# EAGLE design OpenEVSE_PLUS_v2_30a (EAGLE 6.5.0)
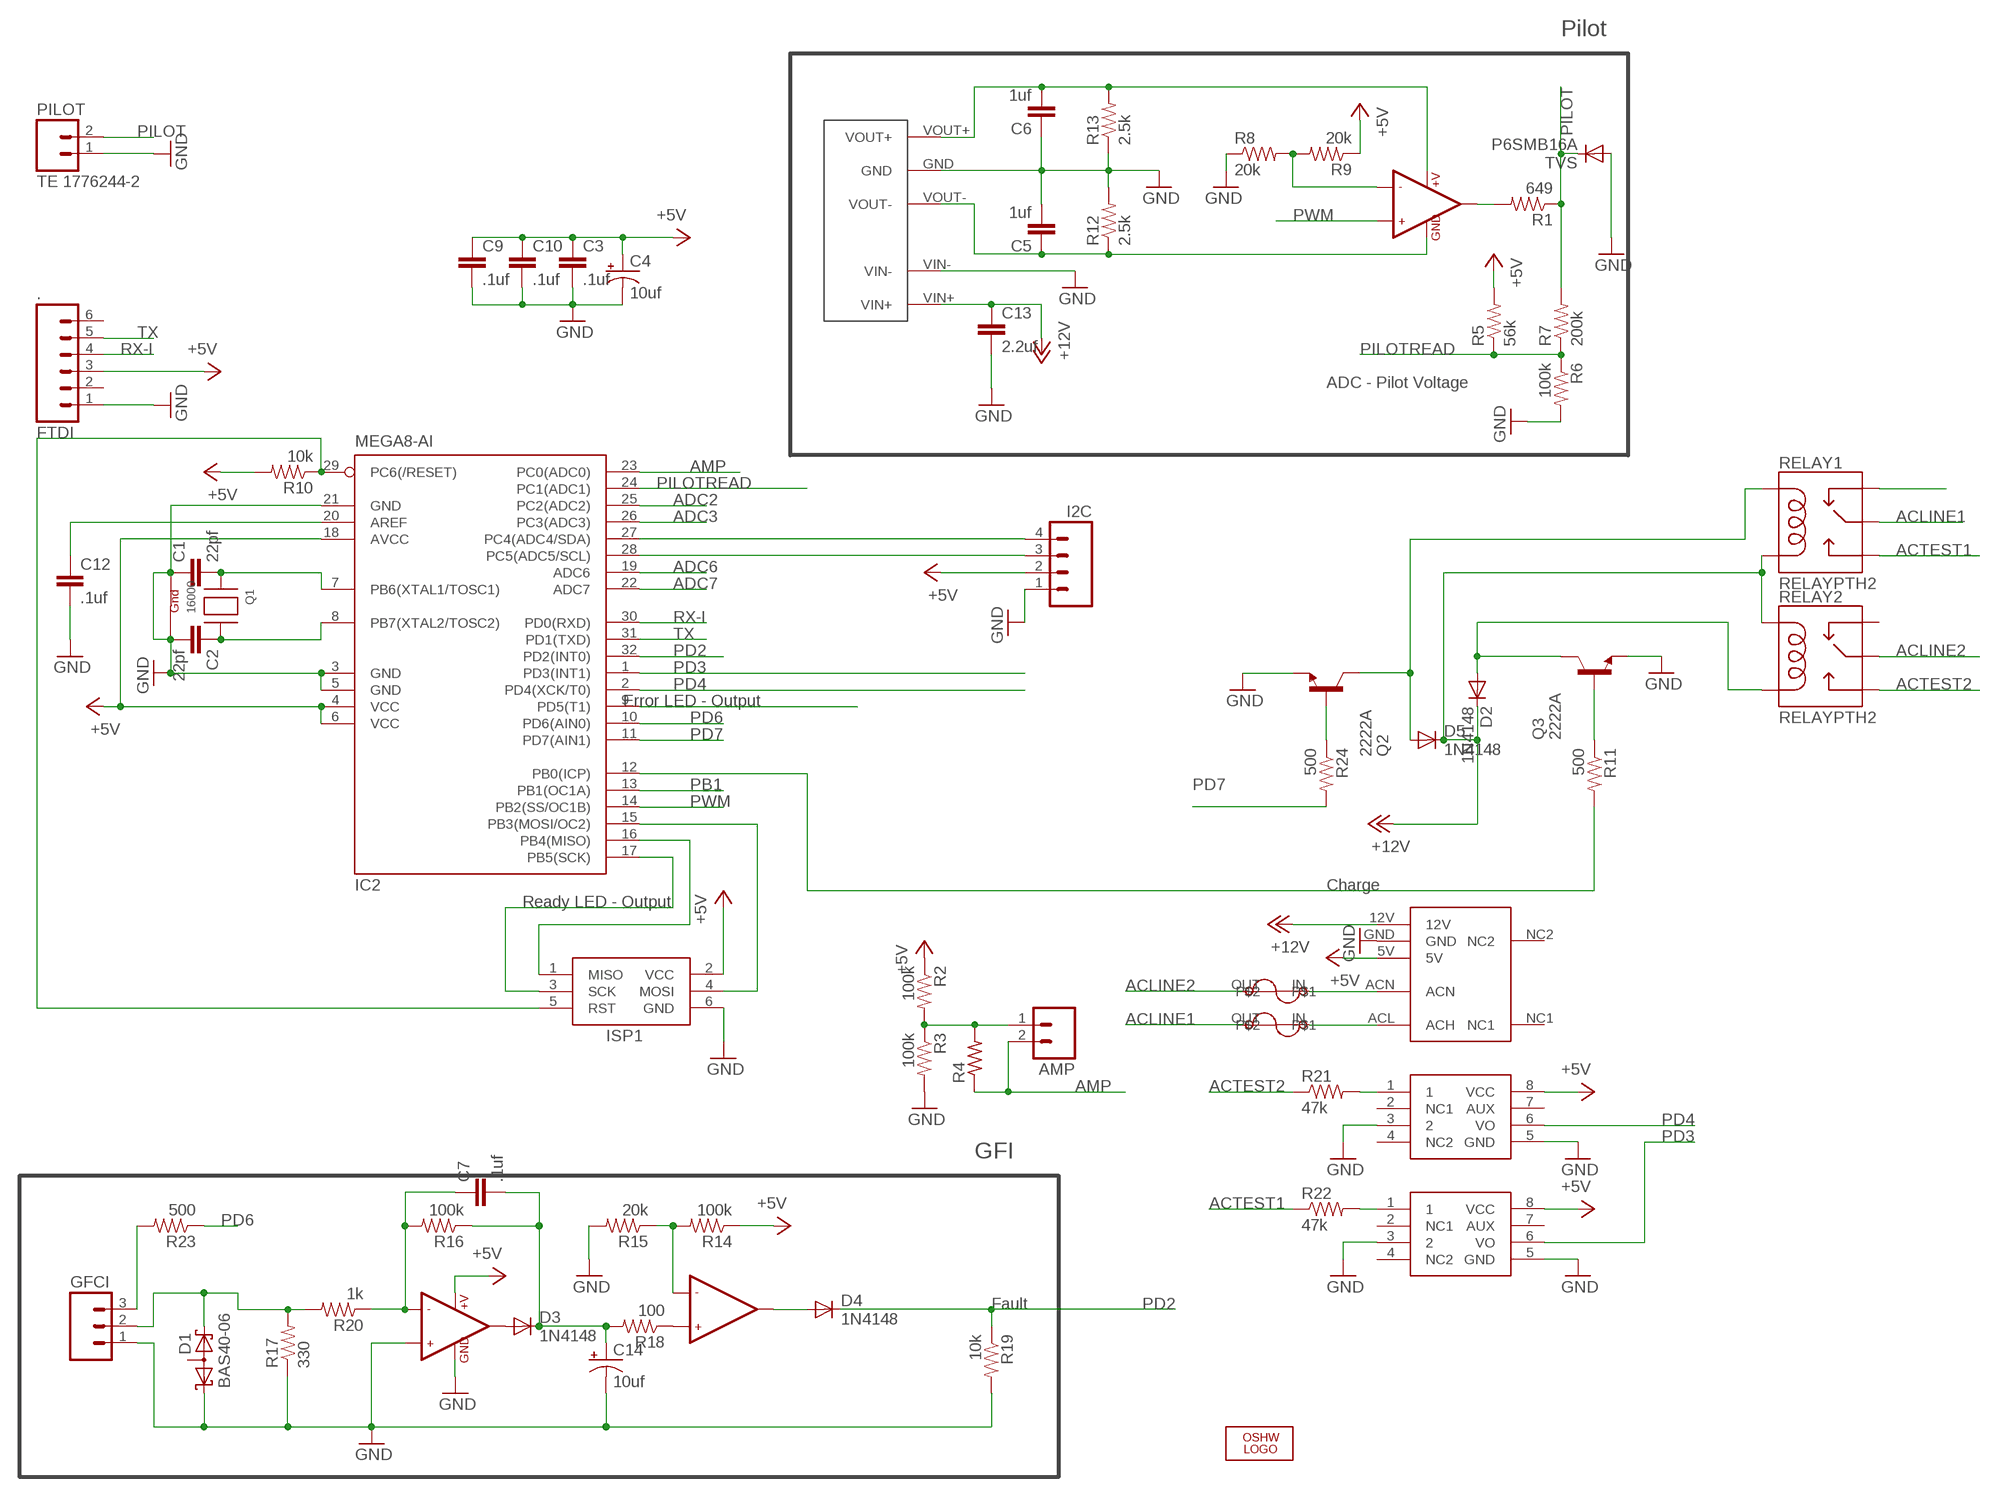
[diagram p0: schematic, sheet 1]

## Parts
.  FTDI  M06LOCK  [1X06_LOCK]
AMP  M02LOCK  [1X02_LOCK]
C1  22pf  CAP0805  [0805]
C2  22pf  CAP0805  [0805]
C3  .1uf  CAP0805  [0805]
C4  10uf  CAP_POL1206  [EIA3216]
C5  1uf  CAP0805  [0805]
C6  1uf  CAP0805  [0805]
C7  .1uf  CAP0805  [0805]
C9  .1uf  CAP0805  [0805]
C10  .1uf  CAP0805  [0805]
C12  .1uf  CAP0805  [0805]
C13  2.2uf  CAP0805  [0805]
C14  10uf  CAP_POL1206  [EIA3216]
D1  BAS40-06  [SOT23]
D2  1N4148  DIODE-SOD123  [SOD123]
D3  1N4148  DIODE-SOD123  [SOD123]
D4  1N4148  DIODE-SOD123  [SOD123]
D5  1N4148  DIODE-SOD123  [SOD123]
DCDC  D107E  DCDC_SIP  [DCDC_SIP]
GFCI  M03LOCK  [1X03_LOCK]
I2C  M04LOCK  [1X04_LOCK]
IC1  MID400  [DIP08]
IC2  MEGA8-AI  [TQFP32-08]
IC3  LMV358  [SO08]
IC4  LMV358  [SO08]
IC5  MID400  [DIP08]
ISP1  AVRISP-6  [AVRISP]
LOGO1  OSHW_LOGO_8MILX0150-NT  [OSHW_8X150_NOTEXT]
PILOT  TE 1776244-2  M025MM  [SCREWTERMINAL-5MM-2]
Q1  16000  XTAL-4-3225  [NX3225]
Q2  2222A  BCX70SMD  [SOT23]
Q3  2222A  BCX70SMD  [SOT23]
R1  649  RESISTOR0805-RES  [0805]
R2  100k  RESISTOR0805-RES  [0805]
R3  100k  RESISTOR0805-RES  [0805]
R4  R-US_0207/2V  [0207/2V]
R5  56k  RESISTOR0805-RES  [0805]
R6  100k  RESISTOR0805-RES  [0805]
R7  200k  RESISTOR0805-RES  [0805]
R8  20k  RESISTOR0805-RES  [0805]
R9  20k  RESISTOR0805-RES  [0805]
R10  10k  RESISTOR0805-RES  [0805]
R11  500  RESISTOR0805-RES  [0805]
R12  2.5k  RESISTOR0805-RES  [0805]
R13  2.5k  RESISTOR0805-RES  [0805]
R14  100k  RESISTOR0805-RES  [0805]
R15  20k  RESISTOR0805-RES  [0805]
R16  100k  RESISTOR0805-RES  [0805]
R17  330  RESISTOR0805-RES  [0805]
R18  100  RESISTOR0805-RES  [0805]
R19  10k  RESISTOR0805-RES  [0805]
R20  1k  RESISTOR0805-RES  [0805]
R21  47k  RESISTORPTH-1/4W  [AXIAL-0.4]
R22  47k  RESISTORPTH-1/4W  [AXIAL-0.4]
R23  500  RESISTOR0805-RES  [0805]
R24  500  RESISTOR0805-RES  [0805]
RELAY1  RELAYPTH2  [RELAY-T9A]
RELAY2  RELAYPTH2  [RELAY-T9A]
TVS  P6SMB16A  DIODE-SMB  [SMB]
U$1  MPM-04E-1205  [MPM-04E-1205]
U$2  BEL1AFUSE  [BELFUSE1A]
U$5  BEL1AFUSE  [BELFUSE1A]

## Nets
12V: C6.2 DCDC.VOUT+ IC4.8(+V) R13.2
+5V: ..3 C3.1 C4.A(+) C9.1 C10.1 I2C.2 IC1.8(VCC) IC2.4(VCC) IC2.6(VCC) IC2.18(AVCC) IC3.8(+V) IC5.8(VCC) ISP1.2(VCC) R2.1 R5.2 R9.1 R10.2 R14.1 U$1.5V
+12V: C13.1 D2.C D5.C DCDC.VIN+ RELAY1.COIL2 RELAY2.COIL1 U$1.12V
-12V: C5.1 DCDC.VOUT- IC4.4(GND) R12.1
ACLINE1: RELAY1.MAIN U$2.OUT
ACLINE2: RELAY2.MAIN U$5.OUT
ACTEST1: R22.P$1 RELAY1.NO
ACTEST2: R21.P$1 RELAY2.NO
ADC2: IC2.25(PC2(ADC2))
ADC3: IC2.26(PC3(ADC3))
ADC6: IC2.19(ADC6)
ADC7: IC2.22(ADC7)
AMP: AMP.2 IC2.23(PC0(ADC0)) R4.1
CTA1: AMP.1 R2.2 R3.1 R4.2
GND: ..1 C1.1 C2.2 C3.2 C4.C(-) C5.2 C6.1 C9.2 C10.2 C12.2 C13.2 C14.C(-) D1.1(K1) DCDC.GND DCDC.VIN- GFCI.1 I2C.1 IC1.3 IC1.5(GND) IC2.3(GND) IC2.5(GND) IC2.21(GND) IC3.3(+IN1) IC3.4(GND) IC5.3 IC5.5(GND) ISP1.6(GND) PILOT.1 Q1.1(G1) Q1.3(G2) Q2.2(E) Q3.2(E) R3.2 R6.2 R8.1 R12.2 R13.1 R15.2 R17.1 R19.2 TVS.A U$1.GND
N$1: RELAY1.NC
N$2: Q3.1(B) R11.1
N$4: C1.2 IC2.7(PB6(XTAL1/TOSC1)) Q1.2(X1)
N$5: C2.1 IC2.8(PB7(XTAL2/TOSC2)) Q1.4(X2)
N$7: U$1.ACL(ACH) U$2.IN
N$8: C7.1 IC3.2(-IN1) R16.2 R20.1
N$9: U$1.ACN U$5.IN
N$10: IC4.2(-IN1) R8.2 R9.2
N$11: IC4.1(OUT1) R1.2
N$14: IC2.15(PB3(MOSI/OC2)) ISP1.4(MOSI)
N$15: IC2.17(PB5(SCK)) ISP1.3(SCK)
N$16: IC2.16(PB4(MISO)) ISP1.1(MISO)
N$18: IC1.1 R21.P$2
N$19: IC5.1 R22.P$2
N$20: D1.2(K2) GFCI.2 R17.2 R20.2
N$21: D3.A IC3.1(OUT1)
N$22: GFCI.3 R23.2
N$23: C7.2 C14.A(+) D3.C R16.1 R18.2
N$24: IC3.6(-IN2) R14.2 R15.1
N$25: D4.A IC3.7(OUT2)
N$26: IC3.5(+IN2) R18.1
N$27: D5.A Q2.3(C) RELAY1.COIL1
N$30: Q2.1(B) R24.1
N$34: IC2.12(PB0(ICP)) R11.2
N$36: IC2.9(PD5(T1))
N$39: I2C.4 IC2.27(PC4(ADC4/SDA))
N$40: I2C.3 IC2.28(PC5(ADC5/SCL))
N$44: C12.1 IC2.20(AREF)
PB1: IC2.13(PB1(OC1A))
PD2: D4.C IC2.32(PD2(INT0)) R19.1
PD3: IC2.1(PD3(INT1)) IC5.6(VO)
PD4: IC1.6(VO) IC2.2(PD4(XCK/T0))
PD6: IC2.10(PD6(AIN0)) R23.1
PD7: IC2.11(PD7(AIN1)) R24.2
PILOT: PILOT.2 R1.1 R7.2 TVS.C
PILOTREAD: IC2.24(PC1(ADC1)) R5.1 R6.1 R7.1
PWM: IC2.14(PB2(SS/OC1B)) IC4.3(+IN1)
RELAY: D2.A Q3.3(C) RELAY2.COIL2
RST: IC2.29(PC6(/RESET)) ISP1.5(RST) R10.1
RX-I: ..4 IC2.30(PD0(RXD))
TX: ..5 IC2.31(PD1(TXD))
Unconnected: ..2 ..6 D1.3(AA) IC1.2(NC1) IC1.4(NC2) IC1.7(AUX) IC4.5(+IN2) IC4.6(-IN2) IC4.7(OUT2) IC5.2(NC1) IC5.4(NC2) IC5.7(AUX) RELAY2.NC U$1.NC1 U$1.NC2

## Notes on the sheet
- Pilot
- ADC - Pilot Voltage
- Error LED - Output
- Charge
- Ready LED - Output
- GFI
- Fault

## Library data of the parts
. = SparkFun:M06: Header 6 Standard 6-pin 0.1" header. Use with straight break away headers (SKU : PRT-00116), right angle break away headers (PRT-00553), swiss pins (PRT-00743), machine pins (PRT-00117), and female headers (PRT-00115). Molex polarized connector foot print use with SKU : PRT-08094 with associated crimp pins and housings. NOTES ON THE VARIANTS LOCK and LOCK_LONGPADS... This footprint was designed to help hold the alignment of a through-hole component (i.e. 6-pin header) while soldering it into place. You may notice that each hole has been shifted either up or down by 0.005 of an inch from it's more standard position (which is a perfectly straight line). This slight alteration caused the pins (the squares in the middle) to touch the edges of the holes. Because they are alternating, it causes a "brace" to hold the component in place. 0.005 has proven to be the perfect amount of "off-center" position when using our standard breakaway headers. Although looks a little odd when you look at the bare footprint, once you have a header in there, the alteration is very hard to notice. Also, if you push a header all the way into place, it is covered up entirely on the bottom side. This idea of altering the position of holes to aid alignment will be further integrated into the Sparkfun Library for other footprints. It can help hold any component with 3 or more connection pins.
AMP PILOT = SparkFun:M02: Header 2 Standard 2-pin 0.1" header. Use with straight break away headers (SKU : PRT-00116), right angle break away headers (PRT-00553), swiss pins (PRT-00743), machine pins (PRT-00117), and female headers (PRT-00115). Molex polarized connector foot print use with SKU : PRT-08233 with associated crimp pins and housings.
C1-C3 C5-C7 C9 C10 C12 C13 = SparkFun:CAP: Capacitor Standard 0603 ceramic capacitor, and 0.1" leaded capacitor.
C4 C14 = SparkFun:CAP_POL: Capacitor Polarized These are standard SMD and PTH capacitors. Normally 10uF, 47uF, and 100uF in electrolytic and tantalum varieties. Always verify the external diameter of the through hole cap, it varies with capacity, voltage, and manufacturer. The EIA devices should be standard.
D1 = diode:BAS40-06: Silicon Schottky Diodes General-purpose diode for high-speed switching
D2-D5 TVS = diode:DIODE-: DIODE
DCDC = Qxd:DCDC_SIP
GFCI = SparkFun:M03: Header 3 Standard 3-pin 0.1" header. Use with straight break away headers (SKU : PRT-00116), right angle break away headers (PRT-00553), swiss pins (PRT-00743), machine pins (PRT-00117), and female headers (PRT-00115). Molex polarized connector foot print use with SKU : PRT-08232 with associated crimp pins and housings.
I2C = SparkFun:M04: Header 4 Standard 4-pin 0.1" header. Use with straight break away headers (SKU : PRT-00116), right angle break away headers (PRT-00553), swiss pins (PRT-00743), machine pins (PRT-00117), and female headers (PRT-00115). Molex polarized connector foot print use with SKU : PRT-08231 with associated crimp pins and housings.
IC1 IC5 = SparkFun:MID400
IC2 = atmel:MEGA8: MICROCONTROLLER 8 Kbytes FLASH, 1 kbytes SRAM, 512 bytes EEPROM, USART, 6-channel 10 bit ADC, 2-channel 8 bit ADC Pin compatible with Atmega48, ATMega88, ATMega168 Source: avr.lbr; MPN: ATMEGA8-16AU; OC_FARNELL: 9171371; OC_NEWARK: 73M8863
IC3 IC4 = SparkFun:LMV358
ISP1 = adafruit:AVRISP: AVR ISP HEADER Standard 6 pin header for AVR programming
LOGO1 = ohw-logo:OSHW_LOGO_8MIL
Q1 = adafruit:XTAL-4: Classic 4-pin 3.2 x 2.5mm crystal
Q2 Q3 = transistor-npn:BCX70*: NPN Transistor
R1-R3 R5-R24 = SparkFun:RESISTOR: Resistor Basic schematic elements and footprints for 0603, 1206, and PTH resistors.
R4 = adafruit:R-US_: RESISTOR, American symbol
RELAY1 RELAY2 = SparkFun:RELAY
U$1 = Qxd:MPM-04E-1205
U$2 U$5 = Qxd:BEL1AFUSE

## Board
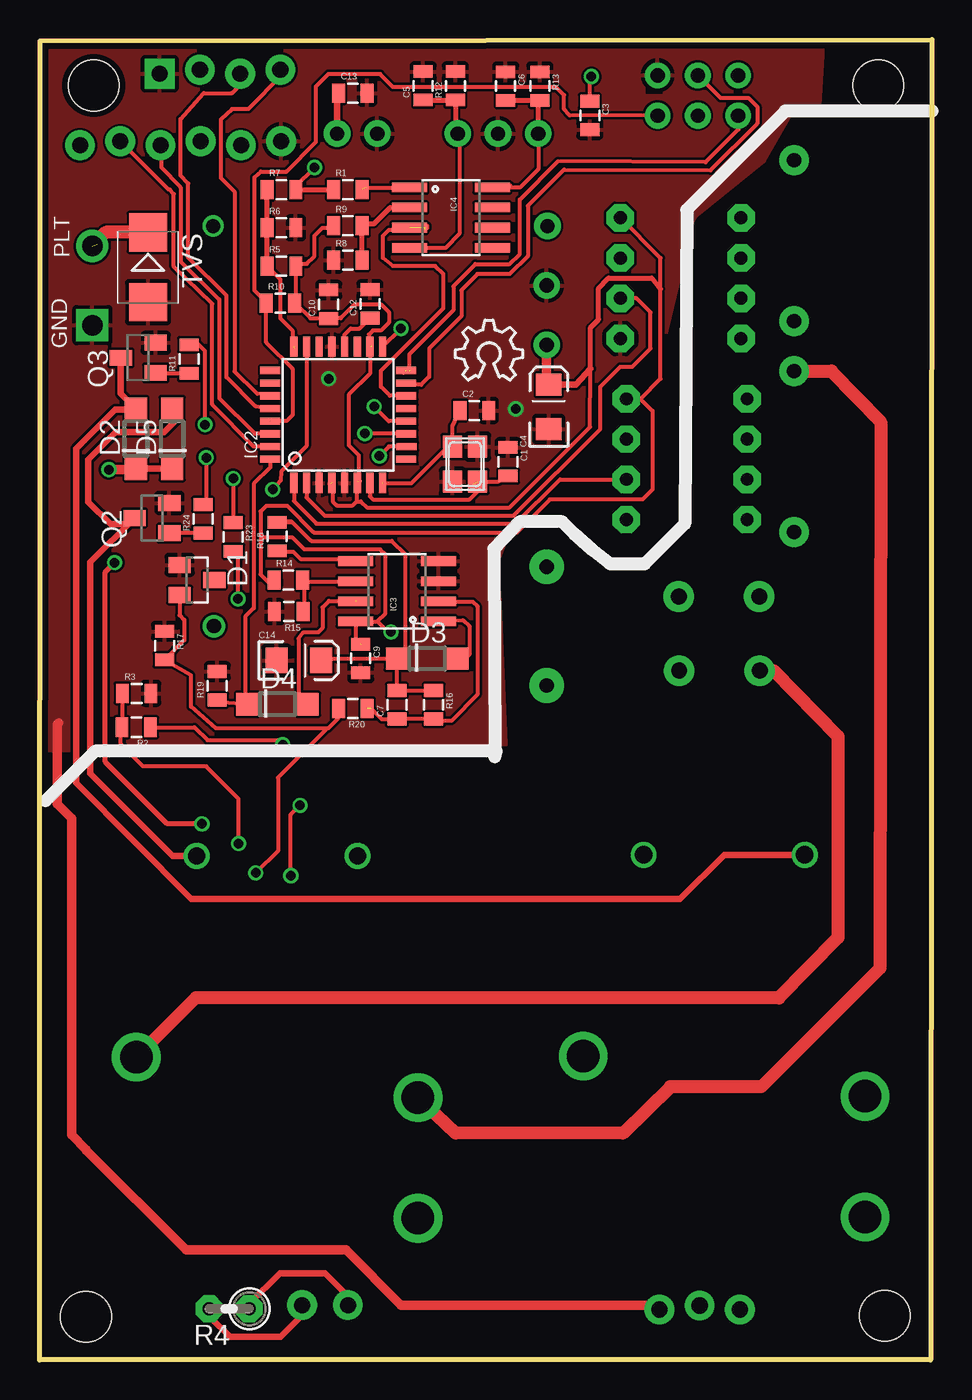
[diagram p1: board, top side]
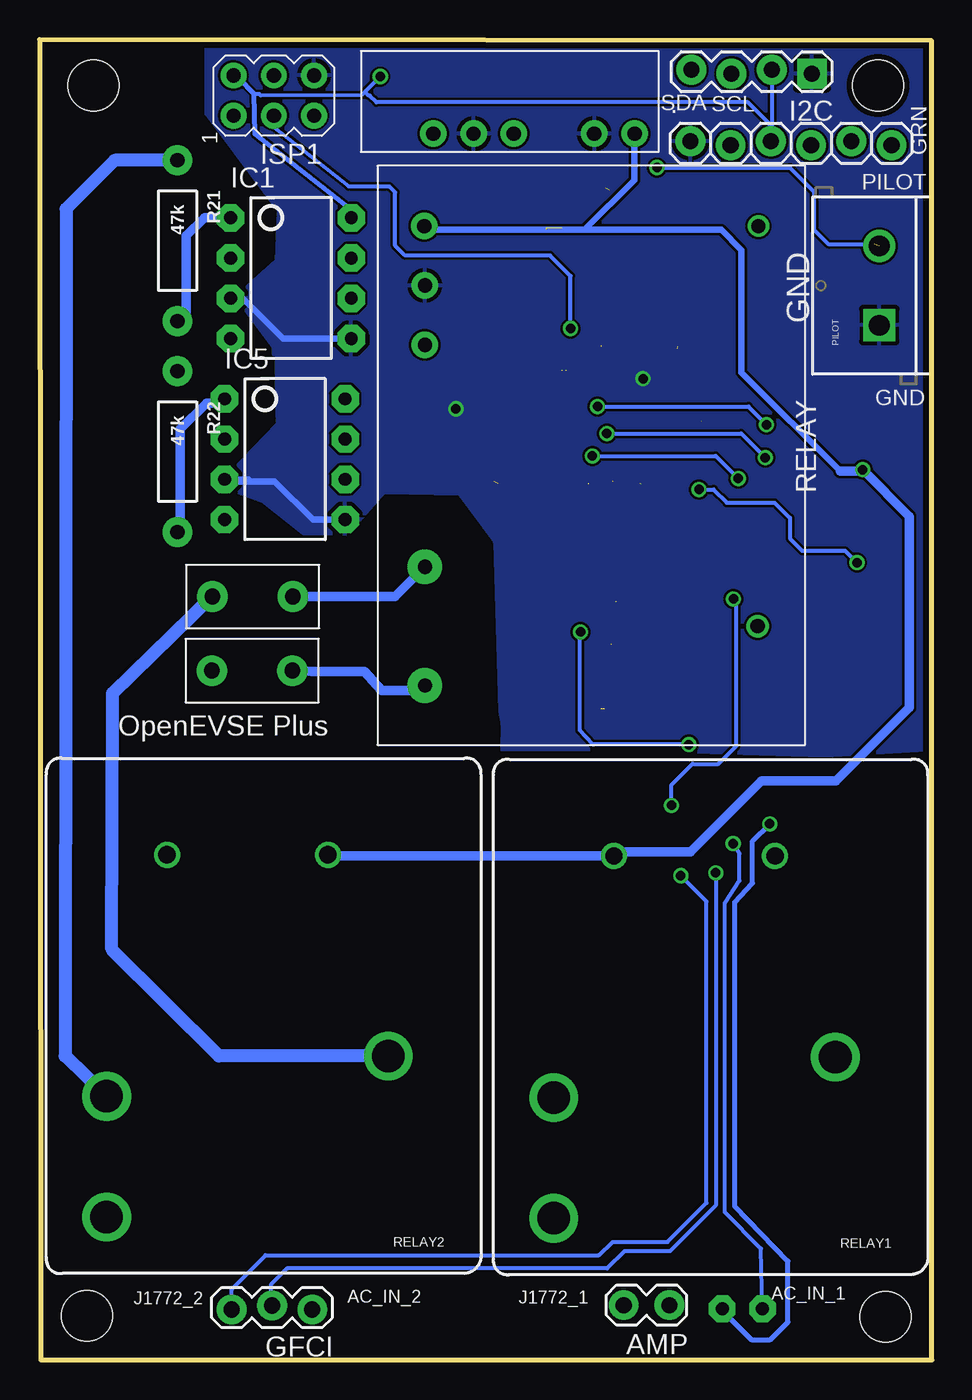
[diagram p2: board, bottom side, seen from below]

Size 56.33 x 83.33 mm. Coordinates in mm from the lower left corner, seen from the top.
Outline: 56.33,83.33 56.26,0 0,0 0.03,83.26 56.33,83.33
Copper layers (1*16): Top 0.0356mm / dielectric 1.5011mm / Bottom 0.0356mm
Design rules "default": minimum track width 6mil, minimum drill 13mil, track to track 6mil, track to pad 6mil, pad to pad 6mil, via to via 6mil, smd to smd 6mil, copper to edge 15mil, drill to drill 6mil, minimum pad ring 7mil, minimum via ring 7mil, stop-mask expansion 4mil, vias tented up to drill 0mil, thermal gap 10mil
Holes 3.2 mm at 52.94,80.43 53.35,2.79 2.93,2.72 3.41,80.44
tRestrict: area 35.5,64.2 to 36.4,64.8; area 36.9,64.2 to 37.8,64.7; area 38.3,79.9 to 39.3,80.7
bRestrict: area 35.5,64.1 to 36.3,64.7; area 37,64 to 37.8,64.7; area 38.6,79.9 to 39.6,80.6

### Footprints (pad centres in the part's own frame; a part is rotated, then mirrored left to right if it is on the bottom)
1X06_LOCK = drill 1.016 pad 1.88: 1 0,0; 2 2.54,-0.254; 3 5.08,0; 4 7.62,-0.254; 5 10.16,0; 6 12.7,-0.254
1X02_LOCK = drill 1.016 pad 1.88: 1 -0.178,0; 2 2.718,0
0805 = smd 0.8 x 1.2: 1 -0.9,0; 2 0.9,0
EIA3216 = smd 1.4 x 1.6: A 1.4,0; C -1.4,0
SOT23 = smd 1 x 1.4: 1 -0.95,-1.1; 2 0.95,-1.1; 3 0,1.1
SOD123 = smd 1.4 x 1.4: A 1.9,0; C -1.9,0
DCDC_SIP = drill 0.9 pad 1.676: GND 10.16,0; VIN+ 0,0; VIN- 2.54,0; VOUT+ 12.7,0; VOUT- 7.62,0
1X03_LOCK = drill 1.016 pad 1.88: 1 0,0.127; 2 2.54,-0.127; 3 5.08,0.127
1X04_LOCK = drill 1.016 pad 1.88 square: 1 0,0.127 | drill 1.016 pad 1.88: 2 2.54,-0.127; 3 5.08,0.127; 4 7.62,-0.127
DIP08 = drill 0.813 pad 1.727 octagon: 1 -3.81,-3.81; 2 -1.27,-3.81; 3 1.27,-3.81; 4 3.81,-3.81; 5 3.81,3.81; 6 1.27,3.81; 7 -1.27,3.81; 8 -3.81,3.81
TQFP32-08 = smd 1.27 x 0.457: 1 -4.293,2.8; 2 -4.293,2; 3 -4.293,1.2; 4 -4.293,0.4; 5 -4.293,-0.4; 6 -4.293,-1.2; 7 -4.293,-2; 8 -4.293,-2.8; 17 4.293,-2.8; 18 4.293,-2; 19 4.293,-1.2; 20 4.293,-0.4; 21 4.293,0.4; 22 4.293,1.2; 23 4.293,2; 24 4.293,2.8 | smd 0.457 x 1.27: 9 -2.8,-4.293; 10 -2,-4.318; 11 -1.2,-4.293; 12 -0.4,-4.293; 13 0.4,-4.293; 14 1.2,-4.293; 15 2,-4.293; 16 2.8,-4.293; 25 2.8,4.293; 26 2,4.293; 27 1.2,4.293; 28 0.4,4.293; 29 -0.4,4.293; 30 -1.2,4.293; 31 -2,4.293; 32 -2.8,4.293
SO08 = smd 0.61 x 2.21: 1 -1.905,-2.616; 2 -0.635,-2.616; 3 0.635,-2.616; 4 1.905,-2.616; 5 1.905,2.616; 6 0.635,2.616; 7 -0.635,2.616; 8 -1.905,2.616
AVRISP = drill 0.9 pad 1.626: 1 -1.27,2.54; 2 1.27,2.54; 3 -1.27,0; 4 1.27,0; 5 -1.27,-2.54; 6 1.27,-2.54
SCREWTERMINAL-5MM-2 = drill 1.3 pad 2.032 square: 1 0,0 | drill 1.3 pad 2.032: 2 5,0
NX3225 = smd 1.4 x 1.2: 1 -1.1,0.8; 2 1.1,0.8; 3 1.1,-0.8; 4 -1.1,-0.8
0207/2V = drill 0.813 pad 1.676 octagon: 1 -1.27,0; 2 1.27,0
AXIAL-0.4 = drill 0.9 pad 1.88: P$1 -5.08,0; P$2 5.08,0
RELAY-T9A = drill 1.092: COIL1 -4.064,-10.16; COIL2 6.096,-10.16 | drill 2.057: MAIN -7.874,2.54; NC 9.906,12.7; NO 9.906,5.08
SMB = smd 2.4 x 2.4: A 2.2,0; C -2.2,0
MPM-04E-1205 = drill 0.9 pad 1.676: 5V 3,25.25; 12V 2.95,32.75; GND 3,29 | drill 0.9 pad 2.184: ACL 3,3.75; ACN 3,11.25 | drill 0.9 pad 1.422: NC1 24,7.5 | drill 0.9: NC2 24.05,32.75
BELFUSE1A = drill 1 pad 1.93: IN 2,1.66; OUT 2,6.74

### Placement (x,y rotation side)
.  15.25,76.91 0 bottom
AMP  16.75,3.46 180 bottom
C1  29.57,56.69 270 top
C2  27.44,59.92 0 top
C3  34.73,78.54 270 top
C4  32.14,60.15 90 top
C5  24.21,80.41 90 top
C6  29.42,80.4 270 top
C7  22.56,41.35 90 top
C9  20.28,44.27 270 top
C10  18.24,66.63 90 top
C12  20.85,66.65 90 top
C13  19.77,79.96 0 top
C14  16.36,44.15 0 top
D1  9.94,49.23 270 top
D2  6.08,58.14 90 top
D3  24.47,44.27 0 top
D4  15.02,41.38 0 top
D5  8.36,58.14 90 top
DCDC  18.78,77.4 180 bottom
GFCI  39.12,3.3 180 bottom
I2C  7.58,81.31 180 bottom
IC1  40.47,68.28 270 bottom
IC2  18.85,59.65 90 top
IC3  22.56,48.52 90 top
IC4  25.96,72.1 270 top
IC5  40.85,56.85 270 bottom
ISP1  41.55,79.8 90 bottom
LOGO1  26.25,61.83 0 top
PILOT  3.33,65.31 90 bottom
Q1  26.85,56.54 270 top
Q2  7.09,53.14 90 top
Q3  6.23,63.25 90 top
R1  19.46,73.86 0 top
R2  6.1,39.93 180 top
R3  6.13,42.06 0 top
R4  11.97,3.23 180 top
R5  15.27,69.04 0 top
R6  15.27,71.45 0 top
R7  15.27,73.86 0 top
R8  19.46,69.42 0 top
R9  19.46,71.58 0 top
R10  15.2,66.7 0 top
R11  9.43,63.17 90 top
R12  26.25,80.41 90 top
R13  31.58,80.4 270 top
R14  15.7,49.23 0 top
R15  15.73,47.22 180 top
R16  24.87,41.35 270 top
R17  7.88,45.09 270 top
R18  14.99,51.97 90 top
R19  11.21,42.55 90 top
R20  19.77,41.12 180 top
R21  47.63,70.64 270 bottom
R22  47.63,57.33 270 bottom
R23  12.22,51.94 270 top
R24  10.32,53.09 90 top
RELAY1  13.98,21.64 180 bottom
RELAY2  42.2,21.72 180 bottom
TVS  6.84,68.96 270 top
U$1  35.01,38.81 0 bottom
U$2  38.72,41.51 90 bottom
U$5  38.69,46.18 90 bottom

### Tracks (layer width: path | path; a pad name or v marks a point on that pad's centre or on a via)
12V
  Top 0.254: 29.71,74.12 IC4.8 28.84,73.99 30.31,73.99 31.48,75.16 DCDC.VOUT+ | 31.48,79.55 31.52,79.55 R13.2
  Top 0.305: DCDC.VOUT+ 31.48,79.55 31.45,79.58 | C6.2 R13.2
+5V  (via drill 0.6)  (4 unrouted)
  Top 0.254: 20.91,64 IC2.18 20.85,62.25 19.51,60.91 19.51,57.74 20.15,57.1 20.15,55.26 | IC1.8 36.79,72.21 | 15.03,48.94 R14.1 14.83,49.07 14.43,49.1 13.95,49.58 13.95,52.07 | 37.93,60.66 39.2,61.93 39.2,67.59 39.2,69.55 IC1.8 | 18.5,55.2 18.5,54.18 18.75,53.93 19.77,53.93 20.02,54.18 | 34.78,62.56 34.75,58.88 29.67,53.8 20.66,53.8 20.28,54.18 20.02,54.18 | 36.66,72.21 36.54,72.1 36.56,72.09 IC1.8 | 20.02,55.32 20.02,54.18 | C9.1 19.95,45.49 IC3.8 21.34,46.61 | 16.17,66.71 R5.2 16.17,69.19 16.87,69.19 17.36,69.67 17.36,70.94 17.86,71.45 18.63,71.45 18.63,71.51 R9.1 | 16.17,66.71 16.09,66.63 R10.2 | 16.17,66.71 16.17,66.67 17.1,65.74 18.37,65.74 | 20.91,63.96 20.78,64.09 20.78,64.72 21.04,64.98 21.55,64.98 22.05,65.48 22.05,66.12 21.55,66.63 19.9,66.63 19.01,65.74 18.37,65.74 | 18.37,65.74 18.24,65.61 C10.1 | 20.15,54.94 20.15,55.26 | 20.15,55.26 IC2.6 | IC5.8 37.93,60.66 | 37.93,60.66 38.69,59.9 38.69,54.94 38.06,54.31 32.21,54.31 30.13,52.22 17.3,52.22 15.65,53.9 14.31,53.9 13.95,53.55 13.95,52.07 | 32.09,61.55 C4.A | 43.87,80.8 43.87,80.89 ISP1.2 | C3.1 34.73,80.6 v34.83,81 | 21.34,46.61 21.34,46.64 21.83,47.12 21.83,50.83 21.5,51.16 16.72,51.16 15.98,51.89 14.13,51.89 13.95,52.07 | R2.1 9.79,39.93 10.6,39.12 15.09,39.12 v15.35,38.84 | v22.18,45.95 22,45.95 21.34,46.61
  Top 0.305: IC2.6 20.09,55.31 | 43.87,81.31 43.87,80.8 | 34.78,62.56 34.78,65.15 35.29,65.66 35.29,67.62 35.92,68.28 38.64,68.28 39.2,67.59
  Top 0.406: IC2.6 20.15,55.46 | 20.15,55.45 20.02,55.32 | 18.37,55.32 18.5,55.2 | 15.03,48.94 15.03,49.19 | 32.09,61.55 33.87,61.55 34.78,62.56
  Top 0.61: U$1.5V 32.01,61.63 32.09,61.55
  Bottom 0.254: 10.24,76.79 10.24,76.84 | 10.24,76.84 ..3 10.12,76.97 I2C.2 | ISP1.2 43.85,80.9 43.82,80.93 | 42.78,79.91 42.48,79.91 42.37,79.81 35.97,79.86 35.8,80.04 | 35.8,80.04 v34.83,81 | 35.8,80.04 35.56,79.8 35.5,79.8 35.07,79.38 11.61,79.38 10.24,78.01 10.24,76.84 | v15.35,38.84 21.39,38.84 22.23,39.73 22.23,45.9 v22.18,45.95
  Bottom 0.305: IC1.8 36.66,72.6 42.73,77.37 42.78,79.91 43.72,80.85 43.82,80.93 43.87,80.93 | ..3 10.17,77.86
+12V  (via drill 0.6)
  Top 0.254: C13.1 18.87,79.87 18.78,79.78
  Top 0.406: DCDC.VIN+ 18.78,79.78 18.78,80.11 18.88,80.22 | D5.C 6.59,56.24 D2.C
  Top 0.61: v4.38,56.19 6.53,56.19 6.59,56.24
  Bottom 0.406: DCDC.VIN+ 18.78,74.47 21.93,71.33 | 21.93,71.33 31.82,71.33 U$1.12V | 21.93,71.33 13.29,71.33 12.02,70.06 12.02,62.31 5.8,56.09
  Bottom 0.61: RELAY2.COIL1 38.56,31.8 RELAY1.COIL2 19.82,32.06 15.25,32.06 10.78,36.53 6.08,36.53 1.43,41.18 1.43,53.24 v4.38,56.19 4.48,56.09 5.8,56.09
-12V
  Top 0.254: 26.5,77.29 26.5,71.07 25.61,70.18 23.61,70.18 IC4.4 | 26.18,79.51 R12.1
  Top 0.305: C5.1 26.18,79.51 26.25,79.58 R12.1 26.25,77.55 DCDC.VOUT- 26.5,77.29
ACLINE1
  Top 0.813: U$2.OUT 46.34,43.51 50.4,39.37 50.4,26.65 46.67,22.84 9.86,22.86 RELAY1.MAIN
ACLINE2
  Bottom 0.813: RELAY2.MAIN 45.02,19.18 51.77,25.91 51.72,42.07 U$5.OUT
ACTEST1
  Top 0.813: R22.P$1 49.99,62.41 53.09,59.21 53.04,24.72 45.55,17.25 39.81,17.25 36.81,14.3 26.27,14.33 RELAY1.NO
ACTEST2
  Bottom 0.813: R21.P$1 51.59,75.72 54.67,72.65 54.72,19.18 RELAY2.NO
AMP  (via drill 0.6)
  Top 0.254: IC2.23 16.85,57.66 15.25,56.06 15.22,55.5 v14.71,54.94
  Top 0.305: v10.24,33.83 8.06,33.83 4.15,37.75 4.15,49.74 v4.73,50.32
  Top 0.406: AMP.2 19.46,4.02 18.02,5.46 15.17,5.46 13.24,3.53 R4.1
  Bottom 0.254: v14.71,54.94 13.8,54.94 12.96,54.1 9.94,54.1 8.97,53.14 8.97,51.84 8.21,51.08 5.49,51.08 v4.73,50.32
  Bottom 0.305: R4.1 13.24,3.1 11.41,1.27 10.22,1.27 9.1,2.39 9.1,6.22 12.45,9.7 12.45,28.88 11.34,30.08 11.34,32.74 v10.24,33.83
CTA1  (via drill 0.6)
  Top 0.254: R3.1 5.23,39.96 R2.2 5.11,39.84 5.11,38.89 6.53,37.47 10.52,37.47 12.55,35.41 v12.55,32.59
  Top 0.406: R4.2 10.78,2.69 12.02,1.45 15.22,1.45 16.54,2.77 16.54,3.43 AMP.1
  Bottom 0.254: R4.2 10.8,7.01 13.09,9.32 13.09,28.83 12.15,30.25 12.15,31.96 v12.55,32.59
GND  (via drill 0.6)
  Top 0.254: C14.C 15.35,43.74
  Top 0.406: 38.84,3.46 GFCI.1
  Top 0.61: 38.84,3.46 22.82,3.46 19.34,6.94 9.25,6.94 2.95,13.24 2.95,13.26 2.01,14.2 2.01,34.16 1.1,35.08 1.1,40.11 1.2,40.21
  Bottom 0.254: IC1.3 44.41,67.01
  Bottom 0.406: 44.41,67.01 44.53,67.13 | IC1.5 40.98,64.47 43.52,67.01 IC1.3 44.41,67.13 | IC5.5 39.07,53.04 41.49,55.45 44.53,55.45 IC5.3 43.14,55.58
  other vias: 30.05,60.02 18.24,61.93
  pour Top: 0.05,83.4 3.31,83.5 45.01,83.35 47.42,78.61 45.73,75.67 40.64,71.55 34.9,58.69 26.06,48.45 29.01,48.47 29.42,38.83 24.2,38.46 0.09,38.44 -0.01,63.53 0.05,67.14
  pour Bottom: 0.33,83.46 45.82,82.95 45.83,78.67 41.23,72.52 41.36,69.37 43.97,67.08 41.56,63.88 41.56,63.48 41.38,63.48 41.38,60.81 41.31,59.06 45.02,55.22 42.27,54.23 39.71,52.2 38.89,52.2 36.91,52.12 34.59,54.77 29.86,54.68 27.59,51.61 27.26,40.95 27.13,40.11 27.16,38.54 23.24,38.56 17.13,38.46 6.77,38.16 -0.2,38.57
  pour Top: -0.07,83.53 3.18,83.63 49.43,82.89 49.23,79.15 45.93,78.79 41.2,71.88 39.09,63.01 30.38,54.19 28.81,50.19 28.65,38.81 26.17,38.68 24.07,38.58 -0.04,38.56 -0.14,66.58 -0.07,67.27
N$2
  Top 0.254: Q3.1 9.4,62.3 R11.1
N$4  (1 unrouted)
  Top 0.254: Q1.2 28.97,55.44 C1.2 | IC2.7 20.85,54.5 21.04,54.31 27.13,54.31 27.64,54.82 27.64,55.07 27.39,55.32
N$5  (1 unrouted)
  Top 0.254: Q1.4 26.05,58.94 26.37,59.64 26.37,59.75 C2.1 | Q1.4 26.15,57.52 | Q1.4 25.64,57.52 23.45,55.32 21.67,55.32
N$7
  Bottom 0.254: 31.96,42.5 31.96,42.52 U$1.ACL
  Bottom 0.61: 31.96,42.5 32.21,42.24 34.75,42.24 35.82,43.44 39.15,43.44 U$2.IN
N$8  (1 unrouted)
  Top 0.254: C7.1 R16.2 24.85,40.43 24.85,40.34 25.99,40.34 27.64,41.99 27.64,47.58 27.34,47.86 IC3.2 | 22.52,40.41 C7.1 | 20.91,41.12 21.6,40.44 22.55,40.44 C7.1
N$9
  Bottom 0.61: U$5.IN 33.89,48.18 U$1.ACN
N$10
  Top 0.305: 20.1,69.04 R8.2 R9.2 20.23,71.71 21.11,71.71 22.13,72.73 IC4.2
N$11  (1 unrouted)
  Top 0.254: 20.62,74 IC4.1
N$14
  Top 0.254: 41.31,80.93 41.71,80.93 42.98,79.66 44.74,79.66 45.3,79.1 45.3,78.03 42.35,75.08 33.1,75.14 30.82,72.85 30.82,69.67 29.67,68.53 27.64,68.53 26.63,67.52 26.63,65.86 24.59,63.83 24.59,62.05 24.09,61.55 23.25,61.55 IC2.15 23.17,61.67 | 41.31,80.93 41.21,80.93 | ISP1.4 41.32,80.91 41.31,80.93
N$15  (via drill 0.6)
  Top 0.254: IC2.17 v22.82,65.1
  Bottom 0.254: ISP1.3 41.58,77.82 41.53,77.82 36.81,74.07 34.27,74.07 33.89,73.69 33.89,70.33 33.26,69.7 24.11,69.7 22.82,68.4 v22.82,65.1
N$16  (2 unrouted)
  Top 0.254: IC2.16 23.27,62.56 23.39,62.44 | ISP1.1 44.12,77.67 42.04,75.59 32.72,75.64 30.31,73.23 30.31,69.8 29.67,69.17 27.52,69.17 26.12,67.77 26.12,66.25 23.32,63.45 23.32,62.44 | 23.07,62.44 22.94,62.31
N$18
  Bottom 0.61: R21.P$2 47.07,65.99 47.07,70.94 45.93,72.09 IC1.1
N$19
  Bottom 0.254: 47.45,52.15 47.33,52.15 R22.P$2
  Bottom 0.61: IC5.1 44.53,60.4 45.8,60.4 47.45,58.75 47.45,52.15
N$20  (via drill 0.6)
  Top 0.254: R20.2 18.87,40.5 18.22,39.85 18.14,39.85 | 18.14,39.85 11.13,39.85 9.56,41.23 9.56,43.22 R17.2 9.13,45.43 9.13,46.71 8.84,47 D1.2 | 18.14,39.85 15.04,36.76 15.04,32.13 v13.65,30.74
  Bottom 0.254: v13.65,30.74 13.65,9.76 16.54,6.86 19.41,6.86 20.5,5.77 40.7,5.77 41.74,4.73 41.74,3.81 GFCI.2
N$21
  Top 0.254: IC3.1 26.73,46.69 27.13,46.31 27.13,44.53 26.75,44.15 26.49,44.15 | 26.49,44.15 25.99,44.15 | 26.49,44.15 D3.A
N$22  (via drill 0.6)
  Top 0.254: v15.86,30.56 15.86,34.42 v16.44,35 | v12.53,48.03 12.53,50.74 R23.2
  Bottom 0.254: GFCI.3 44.2,4.45 42.07,6.61 21.04,6.61 20.15,7.44 16.69,7.44 14.23,9.91 14.23,28.93 v15.86,30.56 | v16.44,35 16.44,36.3 15.12,37.62 13.49,37.62 12.35,38.76 12.35,47.86 v12.53,48.03
N$23
  Top 0.254: 24.85,42.5 25.1,42.24 25.1,42.12 24.96,42.25 R16.1 C7.2 22.56,43.9 D3.C | 15.87,52.87 R18.2 14.91,52.87 14.87,52.91 | C14.A 17.86,44.15 17.99,44.27 22.44,44.27 | 22.44,44.27 22.56,44.15 | 22.44,44.27 D3.C | D3.C 22.44,44.15 23.07,44.53 23.07,50.85 22.23,51.69 17.15,51.69 15.91,52.91 15.58,52.91 15.45,52.78 15.32,52.91 14.87,52.91 | 14.87,52.91 14.82,52.91
N$24
  Top 0.254: 16.72,46.9 16.72,47.2 | 16.72,47.2 16.72,49.01 R14.2 16.77,49.13 19.82,49.13 IC3.6 | R15.1 16.69,47.22 16.72,47.2
  Top 0.406: R14.2 16.75,49.13 16.72,49.1
N$25  (1 unrouted)
  Top 0.254: D4.A 16.34,41.91 16.34,45.52 16.67,45.93 17.61,45.93 17.86,46.18 17.86,47.5 18.27,47.91 19.97,47.91
N$26
  Top 0.254: IC3.5 19.82,50.55 16.47,50.55 16.01,51.01 15.06,51.01 R18.1
N$27
  Top 0.406: Q2.3 5.99,53.4 | D5.A 8.64,59.76 8.64,59.34 7.86,58.55 4.81,58.55 3.08,56.82 3.08,54.15 4.48,52.76 5.61,52.76 Q2.3 | RELAY1.COIL1 8.41,31.8 3.21,37.01 3.21,50.35 Q2.3
N$30
  Top 0.254: R24.1 Q2.1
N$34  (via drill 0.6)
  Top 0.254: IC2.12 22.04,59.25 v21.11,60.17 | v10.45,59.03 10.45,63.68 10.01,64.11 9.48,64.11 R11.2
  Bottom 0.254: v21.11,60.17 11.59,60.17 v10.45,59.03
N$36
  Top 0.254: IC2.9
N$39
  Top 0.254: IC2.27 13.73,60.98 12.3,62.38 12.3,73.74 11.44,74.6 11.44,78.28 12.15,78.95 13.16,78.95 15.32,81.1 I2C.4
N$40
  Top 0.254: IC2.28 13.64,60.18 11.79,62.03 11.79,67.18 9.38,69.57 9.38,74.25 8.9,74.75 8.9,78.31 10.37,79.96 12.15,79.96 12.78,80.6 I2C.3
N$44
  Top 0.254: IC2.20 19.25,64.71 19.64,65.1 20.2,65.1 C12.1
PD2
  Top 0.254: D4.C 11.54,41.48 11.21,41.66 | 11.21,41.66 11.13,41.73 | R19.1 11.21,41.66 | IC2.32 14.56,56.34 13.52,55.3 13.52,47.45 12.99,46.92 12.99,41.33 D4.C | 13.52,41.37 D4.C
PD3
  Top 0.254: IC2.1 16.05,54.22 17.48,52.78 30.06,52.78 32.85,55.58 36.91,55.58 36.98,55.64 | 36.98,55.64 37.04,55.7 | IC5.6 36.98,55.64
PD4
  Top 0.254: IC2.2 16.85,54.43 17.99,53.29 29.93,53.29 35.39,58.75 35.39,61.42 36.66,62.69 37.42,62.69 38.56,63.83 38.56,66.12 37.68,67.01 IC1.6
PD6  (via drill 0.6)
  Top 0.254: IC2.10 22.04,57.65 v21.44,57.05 | v12.22,55.63 R23.1
  Bottom 0.254: v21.44,57.05 13.65,57.05 v12.22,55.63
PD7  (via drill 0.6)
  Top 0.254: IC2.11 20.55,58.45 v20.53,58.47 | v10.52,56.95 10.52,54.19 R24.2
  Bottom 0.254: v20.53,58.47 12.05,58.47 v10.52,56.95
PILOT  (via drill 0.6)  (1 unrouted)
  Top 0.254: R7.2 16.17,74.07 v17.36,75.26
  Top 0.305: R7.2 R1.1
  Top 0.406: 16.21,74.04 R7.2
  Top 0.813: TVS.C 4.19,71.16 PILOT.2
  Bottom 0.254: v17.36,75.26 8.97,75.26 7.45,73.74 7.45,71.33 6.56,70.44 3.64,70.44 3.26,70.82
PILOTREAD  (1 unrouted)
  Top 0.254: 16.09,63.83 15.96,63.83 15.96,64.98 15.2,65.74 15.2,68.21 R5.1
  Top 0.305: R7.1 R6.1 R5.1
PWM  (2 unrouted)
  Top 0.254: 24.47,71.45 24.34,71.33 22.05,71.33 21.67,70.94 21.67,69.55 22.31,69.04 24.98,69.04 25.48,68.53 25.48,66.37 21.55,62.44 21.55,61.42 22.12,60.85 IC2.14 | 24.47,71.58 24.34,71.45
RELAY
  Top 0.406: Q3.3 5.13,60.99 D2.A 6.01,59.97 4.76,59.97 2.32,57.53 2.32,36.43 9.56,29.08 40.42,29.08 43.21,31.88 RELAY2.COIL2
RST  (1 unrouted)
  Top 0.254: ISP1.5 33.46,78.56 33.1,78.95 33.1,79.83 32.6,80.34 22.31,80.34 21.5,81.15 18.22,81.15 17.43,80.37 17.43,76.86 15.58,75.01 13.98,75.01 13.55,74.63 13.55,67.52 14.31,66.75 14.3,66.74 R10.1 14.31,66.69 14.31,64.21 15.96,62.56 15.96,59.64 15.58,59.26 IC2.29
RX-I
  Top 0.254: IC2.30 13.59,58.45 11.34,60.71 11.34,66.93 8.9,69.32 8.9,74.02 7.7,75.26 7.7,76.59 ..4
TX
  Top 0.254: IC2.31 13.5,57.65 10.9,60.3 10.9,66.65 8.47,69.01 8.47,73.59 8.21,73.87 8.14,73.87 ..5

### Text on the board
tNames: PLT | GND | _ | _ | _ | _
bNames: GRN | SCL | SDA | PILOT | GND | GND | RELAY | OpenEVSE Plus | AC_IN_1 | J1772_1 | AC_IN_2 | J1772_2